# EAGLE schematic LED-Project (EAGLE 9.6.2)

## Sheet 1 of 2
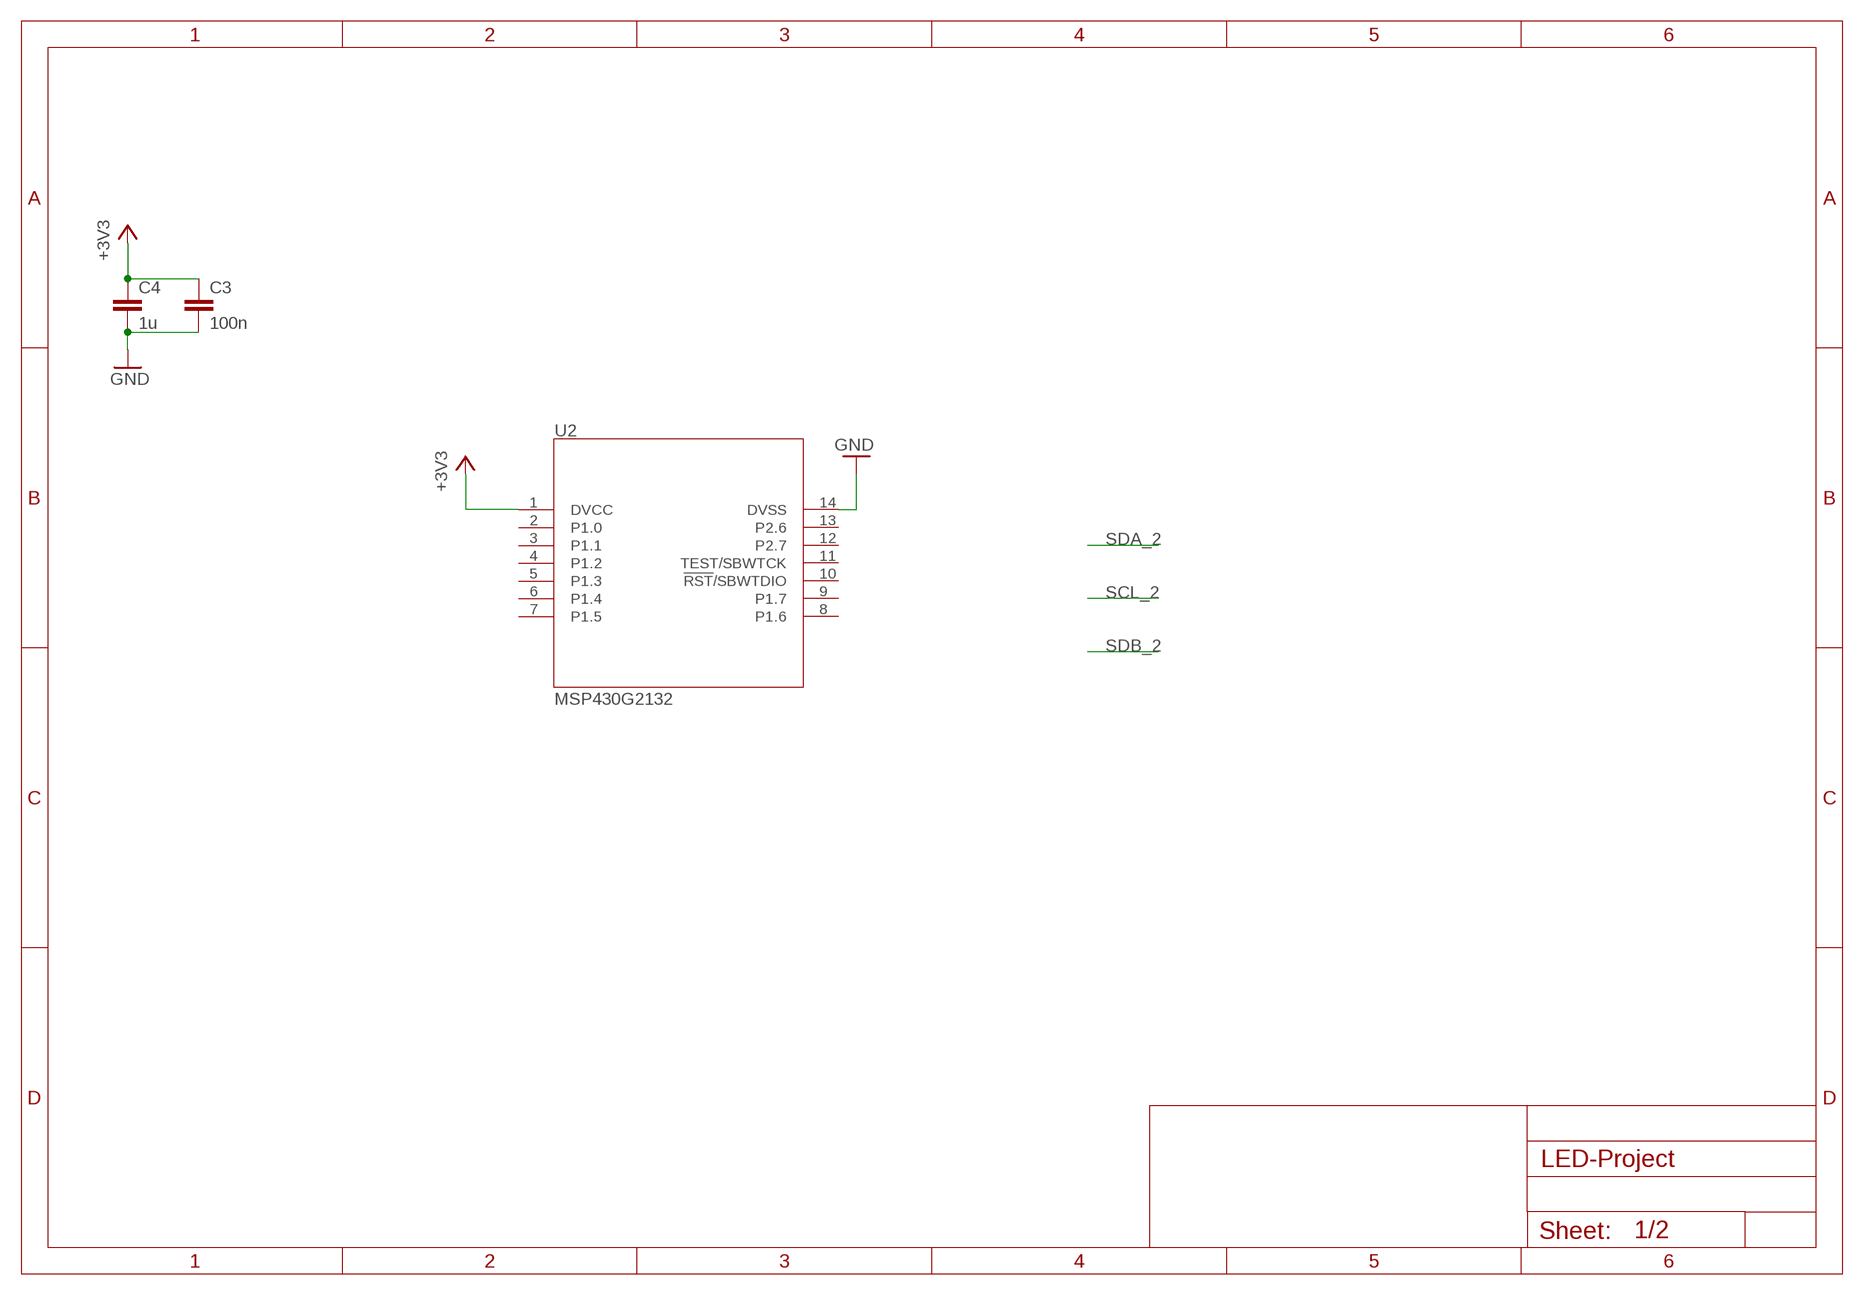
[diagram p0: schematic, sheet 1]

### Parts
C3  100n  C-EUC0805  [C0805]
C4  1u  C-EUC0805  [C0805]
U2  MSP430G2132  [TSSOP14]

### Nets
+3V3: C3.1 C4.1 U2.1(DVCC) ; also sheet 2
GND: C3.2 C4.2 U2.14(DVSS) ; also sheet 2
Unconnected: U2.2(P1.0) U2.3(P1.1) U2.4(P1.2) U2.5(P1.3) U2.6(P1.4) U2.7(P1.5) U2.8(P1.6) U2.9(P1.7) U2.10(!RST!/SBWTDIO) U2.11(TEST/SBWTCK) U2.12(P2.7) U2.13(P2.6)

## Sheet 2 of 2
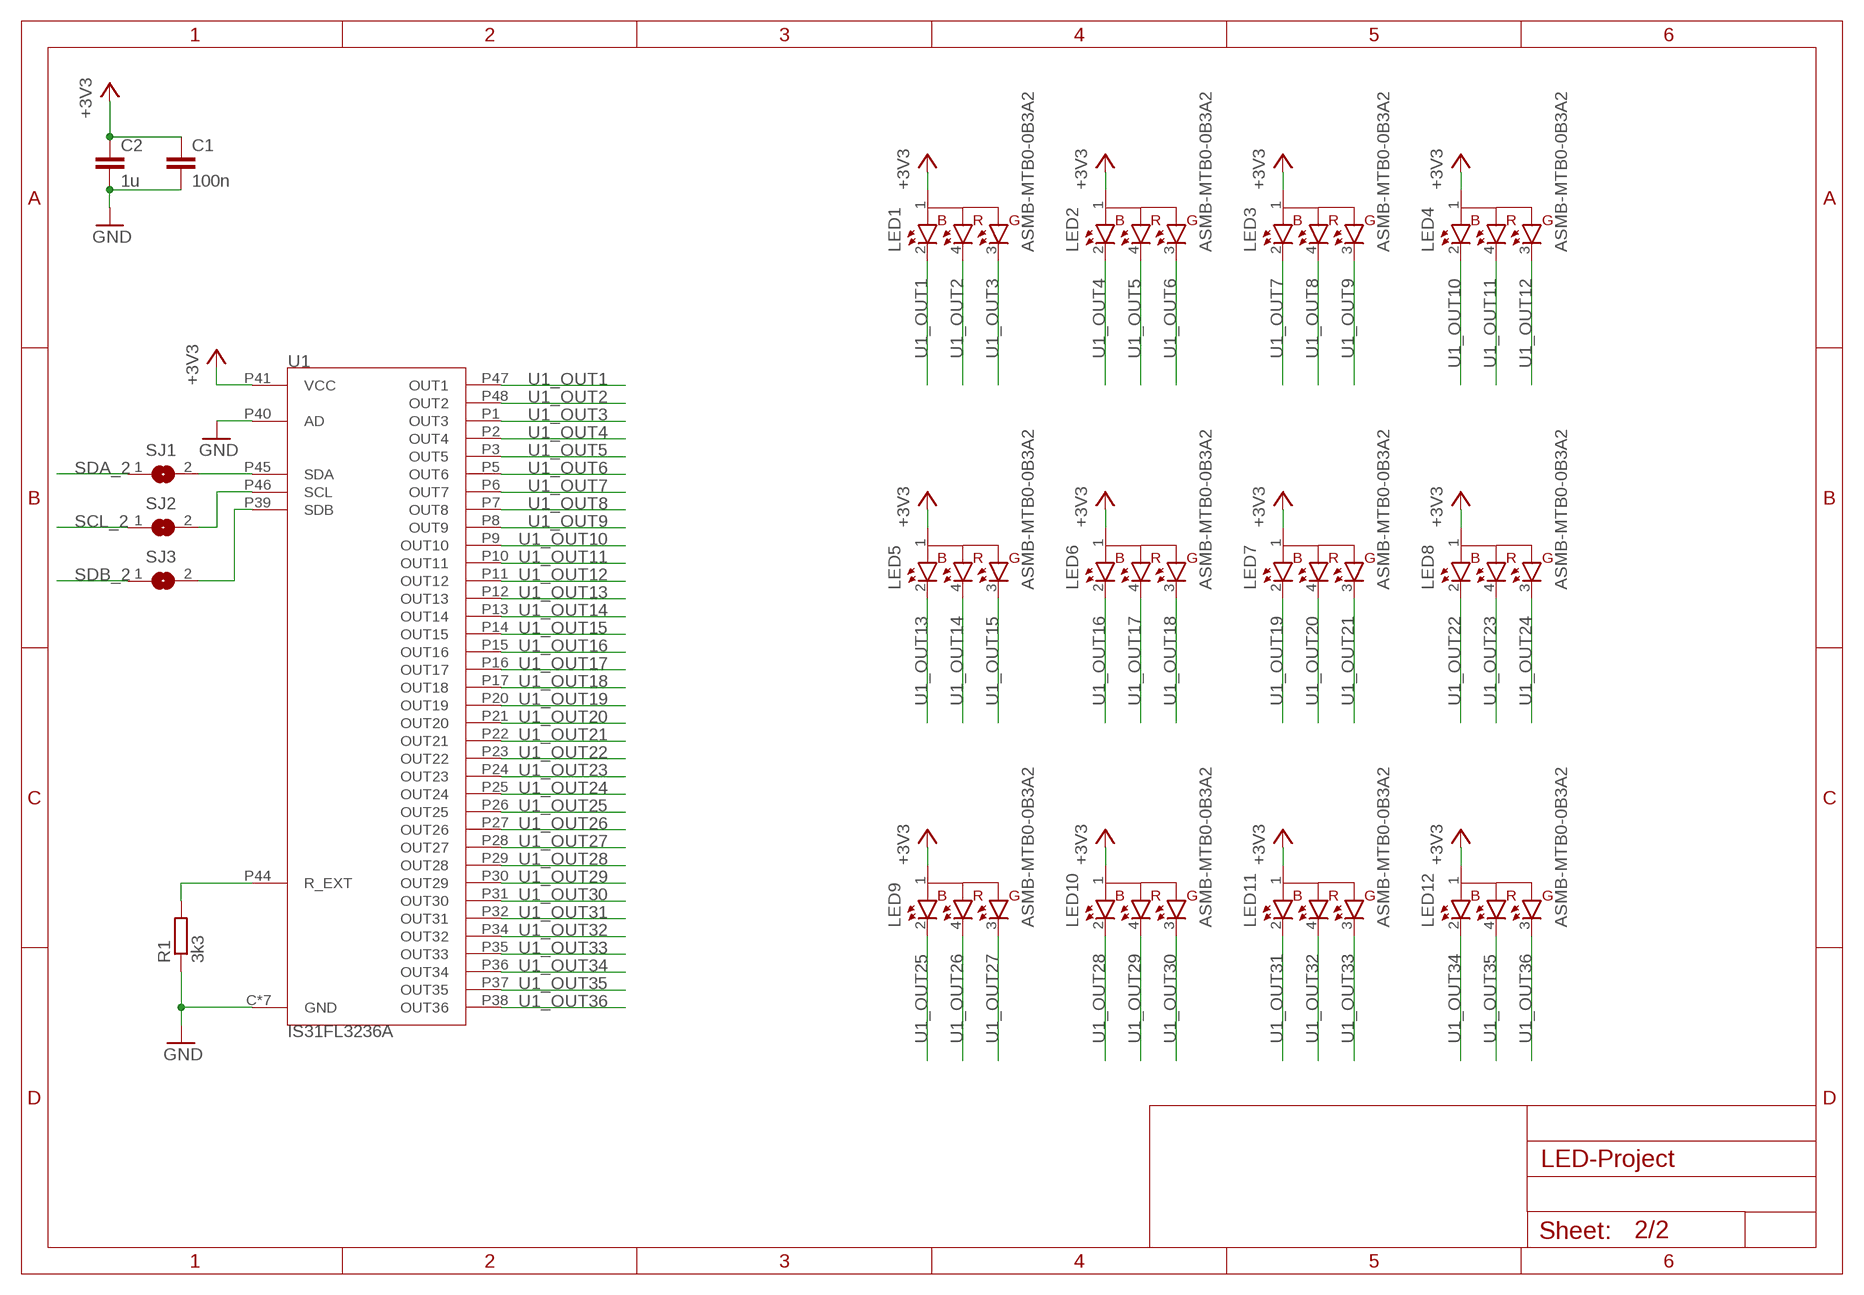
[diagram p1: schematic, sheet 2]

### Parts
C1  100n  C-EUC0805  [C0805]
C2  1u  C-EUC0805  [C0805]
LED1  ASMB-MTB0-0B3A2  [LED-3.2-2.8]
LED2  ASMB-MTB0-0B3A2  [LED-3.2-2.8]
LED3  ASMB-MTB0-0B3A2  [LED-3.2-2.8]
LED4  ASMB-MTB0-0B3A2  [LED-3.2-2.8]
LED5  ASMB-MTB0-0B3A2  [LED-3.2-2.8]
LED6  ASMB-MTB0-0B3A2  [LED-3.2-2.8]
LED7  ASMB-MTB0-0B3A2  [LED-3.2-2.8]
LED8  ASMB-MTB0-0B3A2  [LED-3.2-2.8]
LED9  ASMB-MTB0-0B3A2  [LED-3.2-2.8]
LED10  ASMB-MTB0-0B3A2  [LED-3.2-2.8]
LED11  ASMB-MTB0-0B3A2  [LED-3.2-2.8]
LED12  ASMB-MTB0-0B3A2  [LED-3.2-2.8]
R1  3k3  R-EU_R0805  [R0805]
SJ1  SJ  [SJ]
SJ2  SJ  [SJ]
SJ3  SJ  [SJ]
U1  IS31FL3236A  [ETQFP-48]

### Nets
+3V3: C1.1 C2.1 LED1.1 LED2.1 LED3.1 LED4.1 LED5.1 LED6.1 LED7.1 LED8.1 LED9.1 LED10.1 LED11.1 LED12.1 U1.P41(VCC) ; also sheet 1
GND: C1.2 C2.2 R1.1 U1.C(GND) U1.P4(GND) U1.P18(GND) U1.P19(GND) U1.P33(GND) U1.P40(AD) U1.P42(GND) U1.P43(GND) ; also sheet 1
N$4: R1.2 U1.P44(R_EXT)
SCL: SJ2.2 U1.P46(SCL)
SCL_2: SJ2.1 ; also sheet 1
SDA: SJ1.2 U1.P45(SDA)
SDA_2: SJ1.1 ; also sheet 1
SDB: SJ3.2 U1.P39(SDB)
SDB_2: SJ3.1 ; also sheet 1
U1_OUT1: LED1.2(BC) U1.P47(OUT1)
U1_OUT2: LED1.4(RC) U1.P48(OUT2)
U1_OUT3: LED1.3(GC) U1.P1(OUT3)
U1_OUT4: LED2.2(BC) U1.P2(OUT4)
U1_OUT5: LED2.4(RC) U1.P3(OUT5)
U1_OUT6: LED2.3(GC) U1.P5(OUT6)
U1_OUT7: LED3.2(BC) U1.P6(OUT7)
U1_OUT8: LED3.4(RC) U1.P7(OUT8)
U1_OUT9: LED3.3(GC) U1.P8(OUT9)
U1_OUT10: LED4.2(BC) U1.P9(OUT10)
U1_OUT11: LED4.4(RC) U1.P10(OUT11)
U1_OUT12: LED4.3(GC) U1.P11(OUT12)
U1_OUT13: LED5.2(BC) U1.P12(OUT13)
U1_OUT14: LED5.4(RC) U1.P13(OUT14)
U1_OUT15: LED5.3(GC) U1.P14(OUT15)
U1_OUT16: LED6.2(BC) U1.P15(OUT16)
U1_OUT17: LED6.4(RC) U1.P16(OUT17)
U1_OUT18: LED6.3(GC) U1.P17(OUT18)
U1_OUT19: LED7.2(BC) U1.P20(OUT19)
U1_OUT20: LED7.4(RC) U1.P21(OUT20)
U1_OUT21: LED7.3(GC) U1.P22(OUT21)
U1_OUT22: LED8.2(BC) U1.P23(OUT22)
U1_OUT23: LED8.4(RC) U1.P24(OUT23)
U1_OUT24: LED8.3(GC) U1.P25(OUT24)
U1_OUT25: LED9.2(BC) U1.P26(OUT25)
U1_OUT26: LED9.4(RC) U1.P27(OUT26)
U1_OUT27: LED9.3(GC) U1.P28(OUT27)
U1_OUT28: LED10.2(BC) U1.P29(OUT28)
U1_OUT29: LED10.4(RC) U1.P30(OUT29)
U1_OUT30: LED10.3(GC) U1.P31(OUT30)
U1_OUT31: LED11.2(BC) U1.P32(OUT31)
U1_OUT32: LED11.4(RC) U1.P34(OUT32)
U1_OUT33: LED11.3(GC) U1.P35(OUT33)
U1_OUT34: LED12.2(BC) U1.P36(OUT34)
U1_OUT35: LED12.4(RC) U1.P37(OUT35)
U1_OUT36: LED12.3(GC) U1.P38(OUT36)

## Library data of the parts
C1-C4 = rcl:C-EU: CAPACITOR, European symbol; SPICEPREFIX: C
LED1-LED12 = LED-Project:ASMB-MTB0-0B3A2
R1 = rcl:R-EU_: RESISTOR, European symbol; SPICEPREFIX: R
SJ1-SJ3 = jumper:SJ: SMD solder JUMPER
U1 = LED-Project:IS31FL3236A
U2 = LED-Project:MSP430G2132